# EAGLE design PCB3 (EAGLE 6.3)
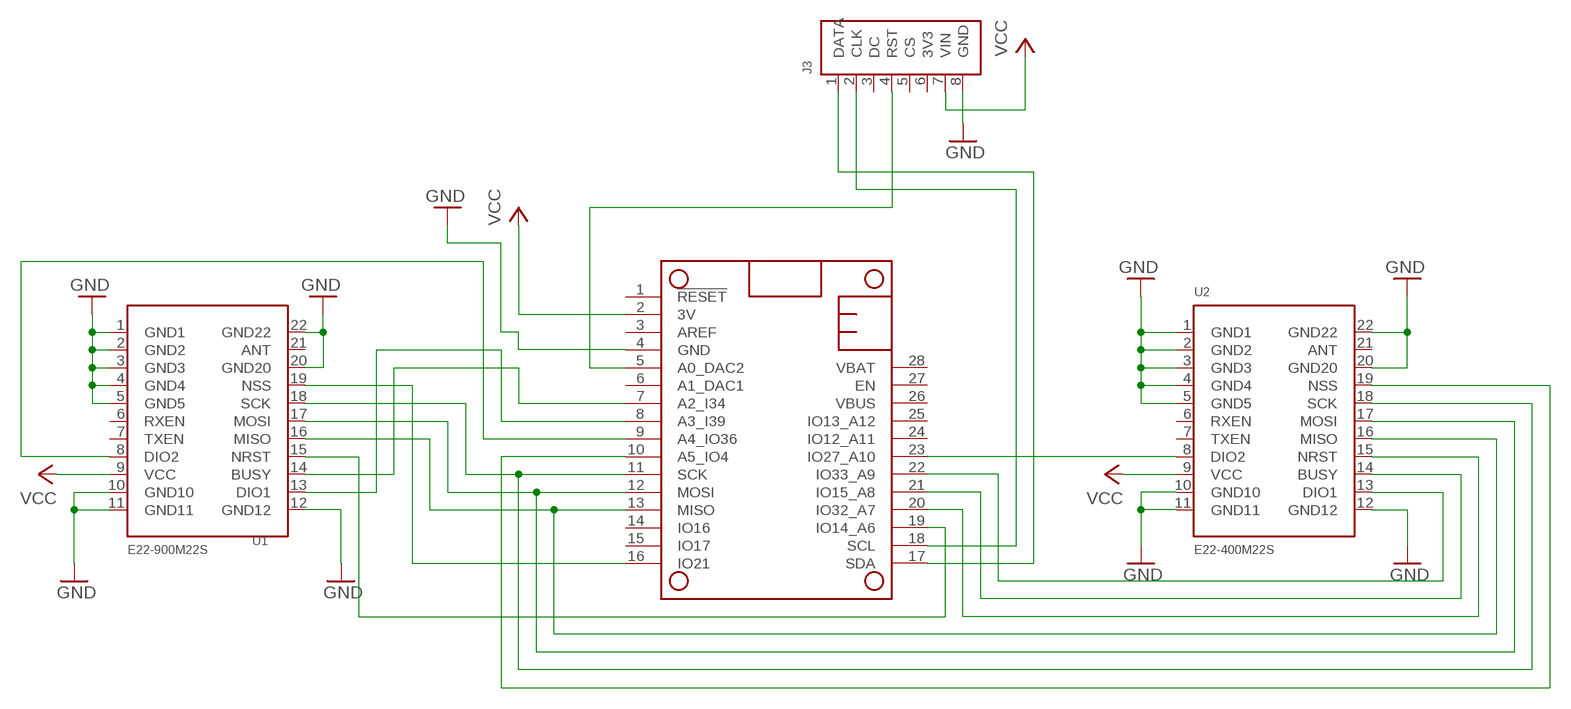
[diagram p0: schematic, sheet 1]

## Parts
J3  1.3"_128X64  [1.3"_128X64_OLED]
MS1  FEATHERWING  [FEATHERWING]
U1  E22-900M22S  [E22]
U2  E22-400M22S  [E22]

## Nets
400BUSY: MS1.21(IO15_A8) U2.14(BUSY)
400CS: MS1.10(A5_IO4) U2.19(NSS)
400NRESET: MS1.20(IO32_A7) U2.15(NRST)
400RXINT: MS1.22(IO33_A9) U2.13(DIO1)
400TXINT: MS1.23(IO27_A10) U2.8(DIO2)
900BUSY: MS1.7(A2_I34) U1.14(BUSY)
900CS: MS1.16(IO21) U1.19(NSS)
900RXINT: MS1.8(A3_I39) U1.13(DIO1)
900TXINT: MS1.9(A4_IO36) U1.8(DIO2)
GND: J3.8(GND) MS1.4(GND) U1.1(GND1) U1.2(GND2) U1.3(GND3) U1.4(GND4) U1.5(GND5) U1.10(GND10) U1.11(GND11) U1.12(GND12) U1.20(GND20) U1.22(GND22) U2.1(GND1) U2.2(GND2) U2.3(GND3) U2.4(GND4) U2.5(GND5) U2.10(GND10) U2.11(GND11) U2.12(GND12) U2.20(GND20) U2.22(GND22)
MISO: MS1.13(MISO) U1.16(MISO) U2.16(MISO)
MOSI: MS1.12(MOSI) U1.17(MOSI) U2.17(MOSI)
N$1: J3.2(CLK) MS1.18(SCL)
N$2: J3.1(DATA) MS1.17(SDA)
N$4: MS1.19(IO14_A6) U1.15(NRST)
RST: J3.4(RST) MS1.5(A0_DAC2)
SCK: MS1.11(SCK) U1.18(SCK) U2.18(SCK)
VCC: J3.7(VIN) MS1.2(3V) U1.9(VCC) U2.9(VCC)
Unconnected: J3.3(DC) J3.5(CS) MS1.1(!RESET) MS1.3(AREF) MS1.6(A1_DAC1) MS1.14(IO16) MS1.15(IO17) MS1.24(IO12_A11) MS1.25(IO13_A12) MS1.26(VBUS) MS1.27(EN) MS1.28(VBAT) U1.6(RXEN) U1.7(TXEN) U1.21(ANT) U2.6(RXEN) U2.7(TXEN) U2.21(ANT)

## Power pins joined to a net without a drawn wire
3V3: J3.6(3V3)

## Library data of the parts
J3 = adafruit:1.3"_128X64: Adafruit 128x64 I2C/SPI 1.3" OLED breakout board
MS1 = adafruit:FEATHERWING
U1 U2 = ebyte:E22

## Net classes
0 default: width 0.406 mm, drill 0.584 mm, clearance 0.203 mm

## Board
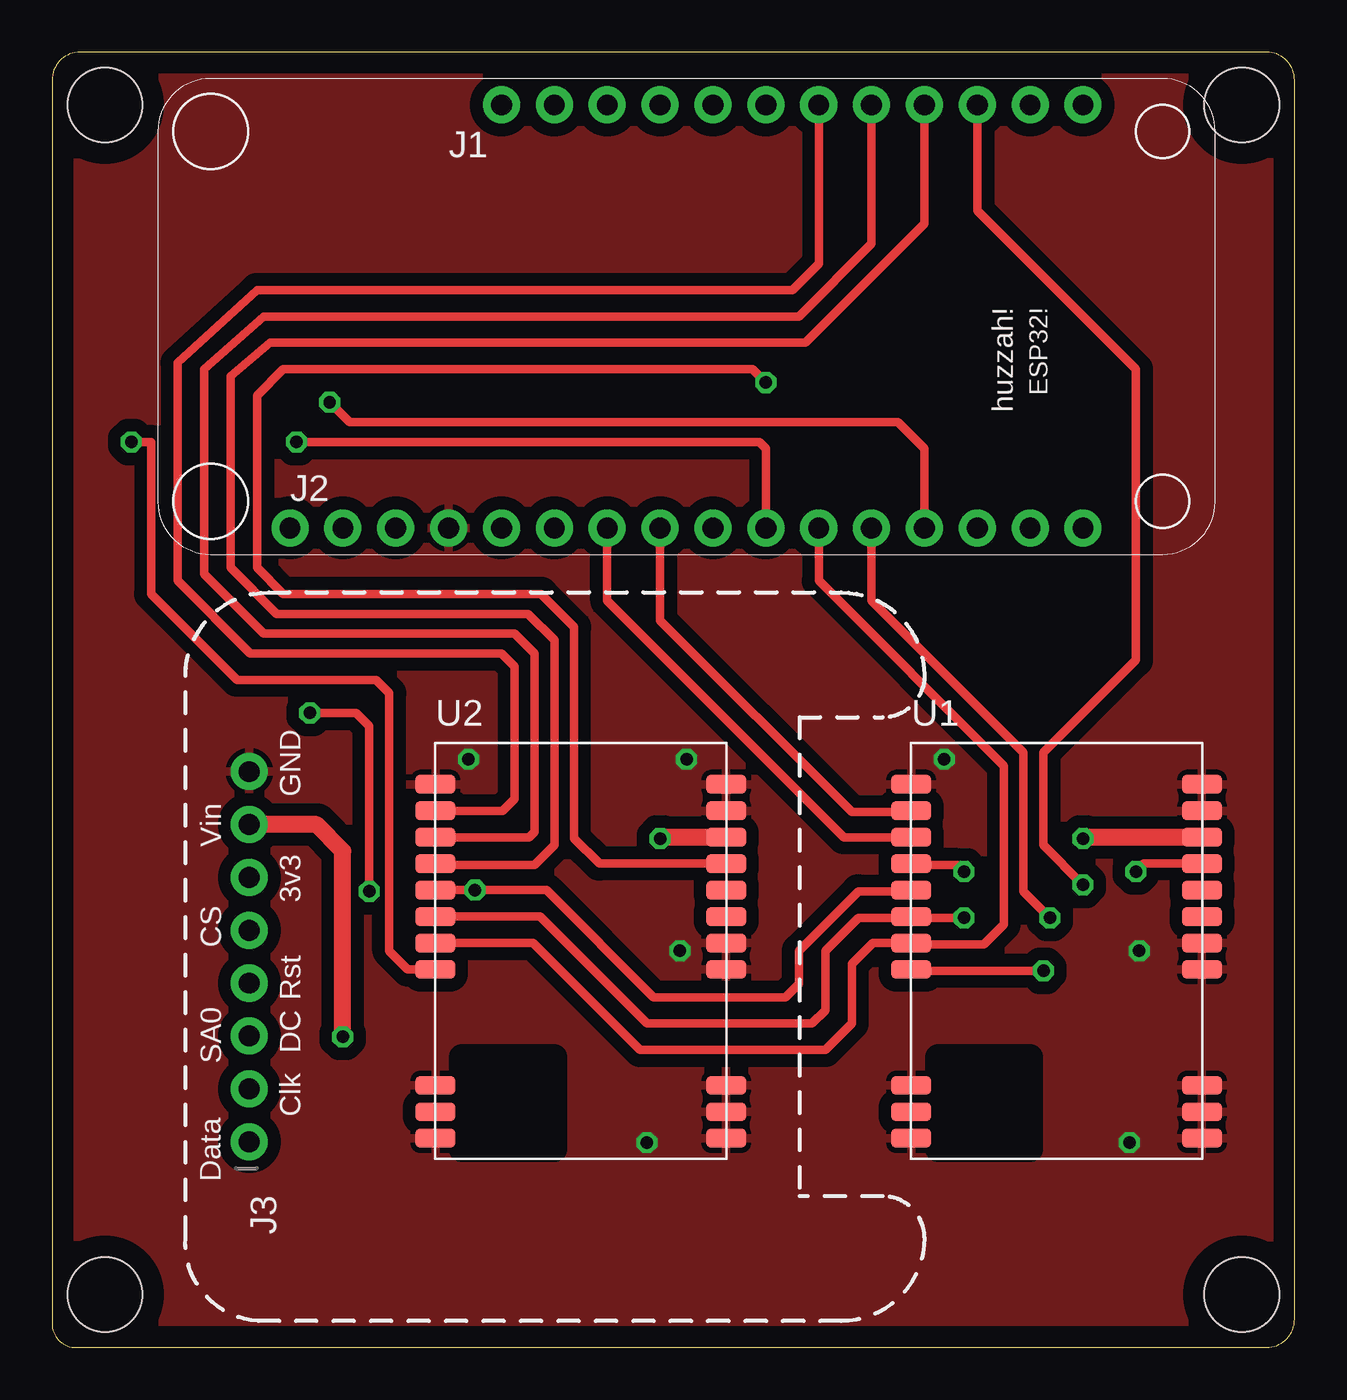
[diagram p1: board, top side]
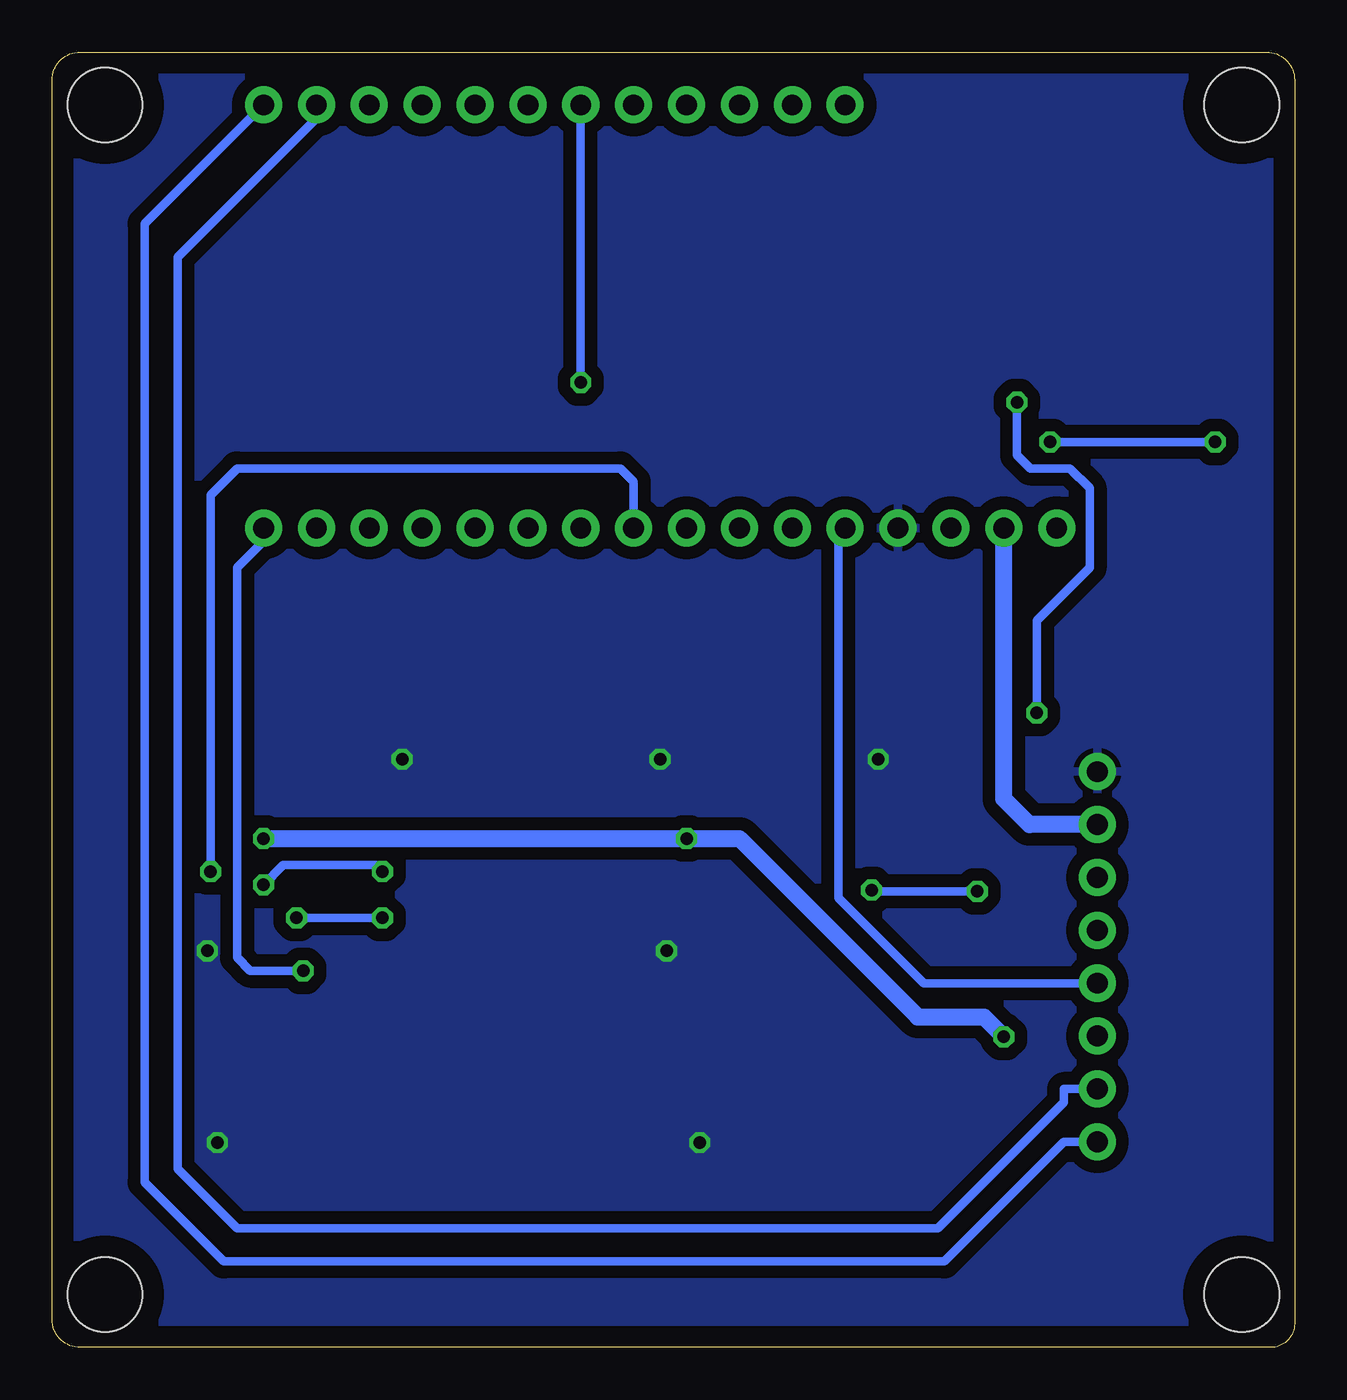
[diagram p2: board, bottom side, seen from below]

Size 59.69 x 62.23 mm. Coordinates in mm from the lower left corner, seen from the top.
Outline: 0,60.88 0,1.15 arc90 1.15,0 58.34,0 arc90 59.69,1.35 59.69,60.88 arc90 58.34,62.23 1.35,62.23 arc90 0,60.88
Copper layers (1*16): Top 0.035mm / dielectric 1.5mm / Bottom 0.035mm
Design rules "default *": minimum track width 6mil, minimum drill 24mil, track to track 12mil, track to pad 8mil, pad to pad 8mil, via to via 8mil, smd to smd 8mil, copper to edge 40mil, drill to drill 8mil, minimum pad ring 10mil, minimum via ring 8mil, stop-mask expansion 4mil, vias tented up to drill 0mil, thermal gap 10mil
Holes 3.59 mm at 2.54,59.69 2.54,2.54 57.15,2.54 57.15,59.69

### Footprints (pad centres in the part's own frame; a part is rotated, then mirrored left to right if it is on the bottom)
1.3"_128X64_OLED = drill 1 pad 1.778: 1 8.611,32.436; 2 11.151,32.436; 3 13.691,32.436; 4 16.231,32.436; 5 18.771,32.436; 6 21.311,32.436; 7 23.851,32.436; 8 26.391,32.436
FEATHERWING = drill 1 pad 1.778: 1 6.35,1.27; 2 8.89,1.27; 3 11.43,1.27; 4 13.97,1.27; 5 16.51,1.27; 6 19.05,1.27; 7 21.59,1.27; 8 24.13,1.27; 9 26.67,1.27; 10 29.21,1.27; 11 31.75,1.27; 12 34.29,1.27; 13 36.83,1.27; 14 39.37,1.27; 15 41.91,1.27; 16 44.45,1.27; 17 44.45,21.59; 18 41.91,21.59; 19 39.37,21.59; 20 36.83,21.59; 21 34.29,21.59; 22 31.75,21.59; 23 29.21,21.59; 24 26.67,21.59; 25 24.13,21.59; 26 21.59,21.59; 27 19.05,21.59; 28 16.51,21.59
E22 = smd 1.905 x 0.9: 1 6.985,-9; 2 6.985,-7.73; 3 6.985,-6.46; 4 6.985,-0.89; 5 6.985,0.38; 6 6.985,1.65; 7 6.985,2.92; 8 6.985,4.19; 9 6.985,5.46; 10 6.985,6.73; 11 6.985,8; 12 -6.985,8; 13 -6.985,6.73; 14 -6.985,5.46; 15 -6.985,4.19; 16 -6.985,2.92; 17 -6.985,1.65; 18 -6.985,0.38; 19 -6.985,-0.89; 20 -6.985,-6.46; 21 -6.985,-7.73; 22 -6.985,-9

### Placement (x,y rotation side)
J3  41.91,1.27 90 top
MS1  5.08,38.1 0 top
U1  48.26,19.05 0 top
U2  25.4,19.05 0 top

### Tracks (layer width: path | path; a pad name or v marks a point on that pad's centre or on a via)
400BUSY
  Top 0.406: MS1.21 39.37,53.02 35.88,49.53 10.16,49.53 7.3,46.99 7.3,37.15 10.16,34.29 22.23,34.29 23.18,33.34 23.18,24.77 22.92,24.51 U2.14
400CS  (via drill 0.6)
  Top 0.406: U2.19 17.08,18.16 16.19,19.05 16.19,31.43 15.56,32.07 8.89,32.07 4.76,36.2 4.76,43.5 v3.81,43.5 | v11.75,43.5 33.97,43.5 34.29,43.18 MS1.10
  Bottom 0.406: v3.81,43.5 v11.75,43.5
400NRESET
  Top 0.406: MS1.20 41.91,53.98 36.2,48.26 10.48,48.26 8.57,46.67 8.57,37.47 10.79,35.24 22.86,35.24 24.13,33.97 24.13,24.13 23.18,23.18 18.48,23.18 U2.15
400RXINT
  Top 0.406: MS1.22 36.83,52.07 35.56,50.8 9.84,50.8 6.03,47.31 6.03,36.83 9.53,33.34 21.59,33.34 22.23,32.7 22.23,26.35 21.65,25.78 U2.13
400TXINT  (via drill 0.6)
  Top 0.406: U2.8 26.29,23.24 25.08,24.45 25.08,34.61 23.5,36.2 11.11,36.2 9.84,37.47 9.84,45.72 11.11,46.99 33.66,46.99 v34.29,46.35
  Bottom 0.406: v34.29,46.35 MS1.23
900BUSY
  Top 0.406: U1.14 38.04,24.51 26.67,35.88 MS1.7
900CS  (via drill 0.6)
  Top 0.406: v47.62,18.1 41.34,18.1 U1.19
  Bottom 0.406: MS1.16 49.53,38.73 50.8,37.47 50.8,18.73 50.16,18.1 v47.62,18.1
900RXINT
  Top 0.406: MS1.8 29.21,34.92 38.42,25.72 41.21,25.72 U1.13
900TXINT  (via drill 0.6)
  Top 0.406: U1.8 52.45,23.24 v52.07,22.86
  Bottom 0.406: v52.07,22.86 52.07,40.96 50.8,42.23 32.38,42.23 31.75,41.59 MS1.9
GND  (via drill 0.6)
  other vias: 20,28.26 30.48,28.26 42.86,28.26 28.57,9.84 51.75,9.84 30.16,19.05 52.23,19.05
  pour Top (isolate 0.61): -1.27,63.5 -1.27,-5.08 60.96,-5.08 60.96,63.5
  pour Bottom (isolate 0.61): -2.54,64.77 -2.54,-2.54 62.23,-2.54 62.23,64.77
MISO  (via drill 0.6)
  Top 0.406: U2.16 19.68,21.97 v20.32,21.97 23.75,21.97 28.89,16.83 35.24,16.83 35.88,17.46 35.88,19.05 38.73,21.91 41.21,21.91 U1.16 | MS1.13 41.91,43.18 40.64,44.45 14.29,44.45 v13.34,45.4 | v12.38,30.48 14.61,30.48 15.24,29.84 v15.24,21.91
  Bottom 0.406: v13.34,45.4 13.34,42.86 12.7,42.23 10.79,42.23 9.84,41.27 9.84,37.47 12.38,34.92 v12.38,30.48 | v15.24,21.91 20.26,21.91 v20.32,21.97
MOSI  (via drill 0.6)
  Top 0.406: U2.17 23.43,20.7 28.57,15.56 36.51,15.56 37.15,16.19 37.15,19.05 38.73,20.64 41.21,20.64 U1.17 41.34,20.64 v43.81,20.64 | MS1.12 39.37,35.88 46.67,28.57 46.67,21.91 v47.94,20.64
  Bottom 0.406: v47.94,20.64 v43.81,20.64
N$1
  Bottom 0.406: J3.2 11.07,12.42 11.07,11.79 17.14,5.71 50.8,5.71 53.66,8.57 53.66,52.39 46.99,59.05 MS1.18
N$2
  Bottom 0.406: MS1.17 55.24,53.98 55.24,7.94 51.44,4.13 16.83,4.13 11.07,9.88 J3.1
N$4  (via drill 0.6)
  Top 0.406: MS1.19 44.45,54.61 52.07,46.99 52.07,33.02 47.62,28.57 47.62,24.13 v49.53,22.23 | v43.81,22.86 43.5,23.18 41.34,23.18 U1.15
  Bottom 0.406: v49.53,22.23 48.58,23.18 44.13,23.18 v43.81,22.86
RST
  Bottom 0.406: J3.4 17.82,17.5 21.91,21.59 21.91,39.05 MS1.5
SCK
  Top 0.406: U2.18 23.11,19.43 28.26,14.29 37.15,14.29 38.42,15.56 38.42,18.41 39.43,19.43 U1.18 41.34,19.37 44.77,19.37 45.72,20.32 45.72,27.94 36.83,36.83 MS1.11
VCC  (via drill 0.6)
  Top 0.813: U1.9 49.91,24.51 v49.53,24.45 | v13.97,14.92 13.97,23.85 12.7,25.12 J3.7 | U2.9 29.27,24.51 v29.21,24.45
  Bottom 0.813: J3.7 12.74,25.12 13.97,26.35 MS1.2 | v49.53,24.45 v29.21,24.45 26.67,24.45 18.1,15.88 14.92,15.88 v13.97,14.92